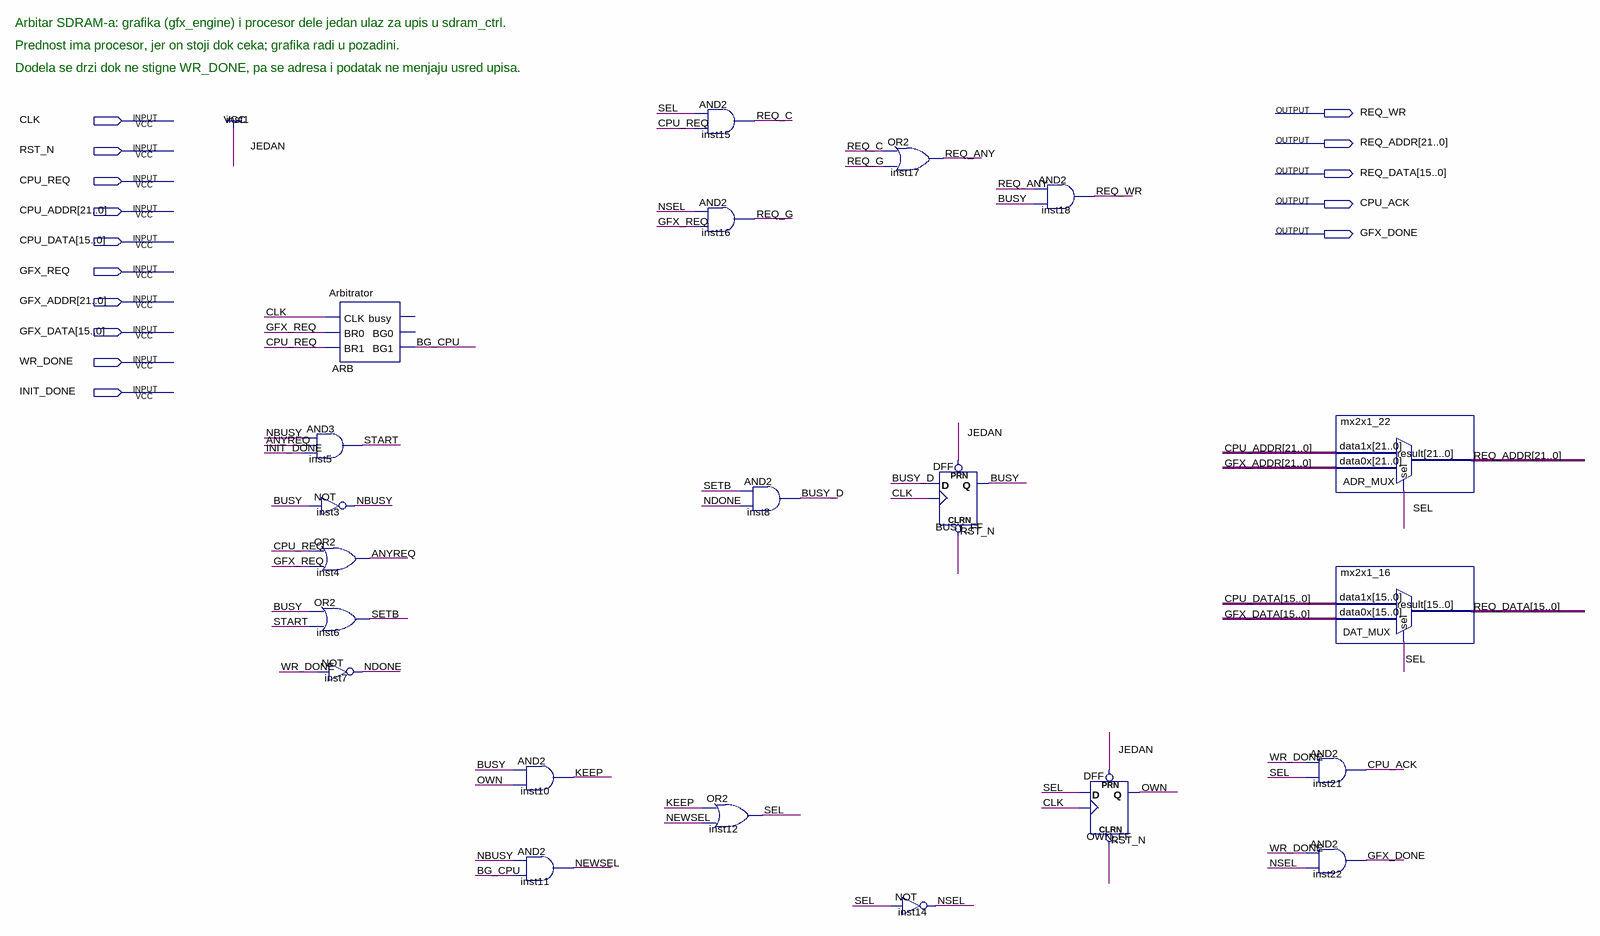
[diagram p0: schematic sheet]
// Quartus schematic sdram_arb.bdf as structural Verilog: 21 symbols, 15 pins
module sdram_arb (
  input  CLK,
  input  RST_N,
  input  CPU_REQ,
  input  [21:0] CPU_ADDR,
  input  [15:0] CPU_DATA,
  input  GFX_REQ,
  input  [21:0] GFX_ADDR,
  input  [15:0] GFX_DATA,
  input  WR_DONE,
  input  INIT_DONE,
  output REQ_WR,
  output [21:0] REQ_ADDR,
  output [15:0] REQ_DATA,
  output CPU_ACK,
  output GFX_DONE
);

  wire ANYREQ, BG_CPU, BUSY, BUSY_D, KEEP, NBUSY, NDONE, NEWSEL, NSEL, OWN, REQ_ANY, REQ_C, REQ_G, SEL, SETB,
       START;

  and inst5 (START, NBUSY, ANYREQ, INIT_DONE);
  not inst3 (NBUSY, BUSY);
  or inst4 (ANYREQ, CPU_REQ, GFX_REQ);
  or inst6 (SETB, BUSY, START);
  Arbitrator ARB (.CLK(CLK), .BR0(GFX_REQ), .BR1(CPU_REQ), .BG1(BG_CPU));  // open: busy, BG0
  not inst7 (NDONE, WR_DONE);
  and inst10 (KEEP, BUSY, OWN);
  and inst11 (NEWSEL, NBUSY, BG_CPU);
  and inst15 (REQ_C, SEL, CPU_REQ);
  and inst16 (REQ_G, NSEL, GFX_REQ);
  or inst12 (SEL, KEEP, NEWSEL);
  and inst8 (BUSY_D, SETB, NDONE);
  or inst17 (REQ_ANY, REQ_C, REQ_G);
  not inst14 (NSEL, SEL);
  DFF BUSY_FF (.CLRN(RST_N), .CLK(CLK), .D(BUSY_D), .PRN(1'b1), .Q(BUSY));
  and inst18 (REQ_WR, REQ_ANY, BUSY);
  DFF OWN_FF (.CLRN(RST_N), .CLK(CLK), .D(SEL), .PRN(1'b1), .Q(OWN));
  mx2x1_22 ADR_MUX (.data1x(CPU_ADDR), .data0x(GFX_ADDR), .sel(SEL), .result(REQ_ADDR));
  mx2x1_16 DAT_MUX (.data1x(CPU_DATA), .data0x(GFX_DATA), .sel(SEL), .result(REQ_DATA));
  and inst21 (CPU_ACK, WR_DONE, SEL);
  and inst22 (GFX_DONE, WR_DONE, NSEL);

  // Notes on the sheet:
  //   Arbitar SDRAM-a: grafika (gfx_engine) i procesor dele jedan ulaz za upis u sdram_ctrl.
  //   Prednost ima procesor, jer on stoji dok ceka; grafika radi u pozadini.
  //   Dodela se drzi dok ne stigne WR_DONE, pa se adresa i podatak ne menjaju usred upisa.
endmodule
